# Altium schematic sheet Sheet2.SchDoc
size A4
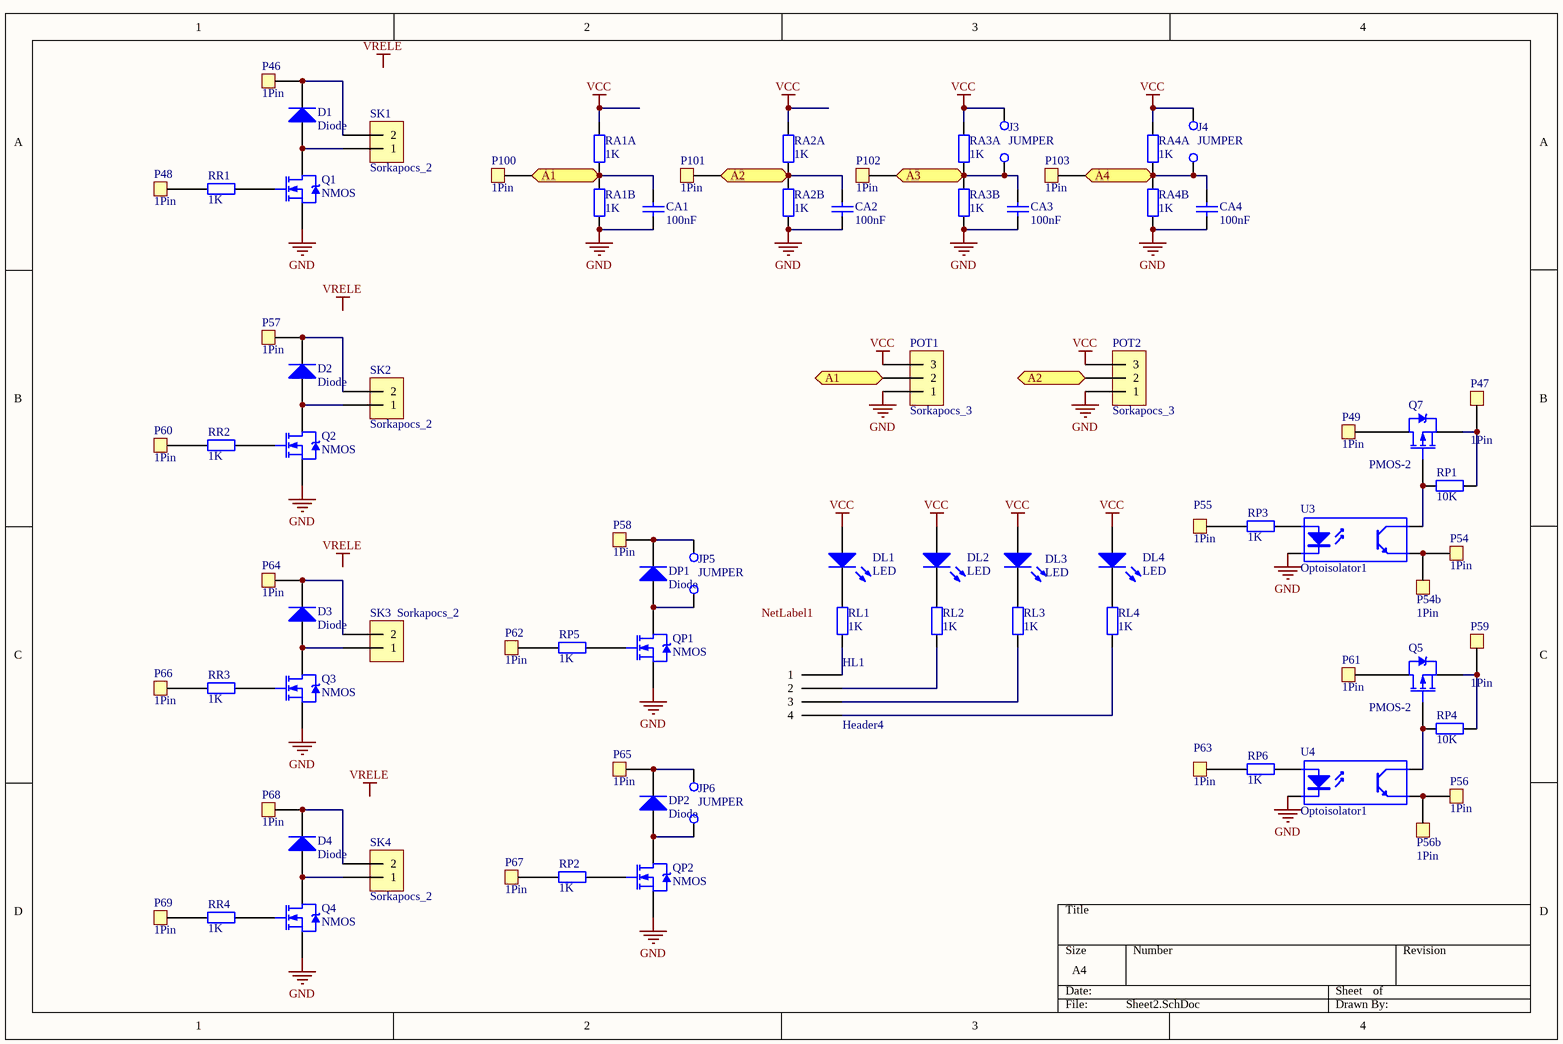
[diagram p0: Sheet2.SchDoc]

## Parts
CA1  100nF  [FP_0805_CAP_085]
CA2  100nF  [FP_0805_CAP_085]
CA3  100nF  [FP_0805_CAP_085]
CA4  100nF  [FP_0805_CAP_085]
D1  Diode  [DO214]
D2  Diode  [DO214]
D3  Diode  [DO214]
D4  Diode  [DO214]
DL1  LED  [FP_0805_LED_RED]
DL2  LED  [FP_0805_LED_RED]
DL3  LED  [FP_0805_LED_RED]
DL4  LED  [FP_0805_LED_RED]
DP1  Diode  [DO214]
DP2  Diode  [DO214]
HL1  Header4  [FP_CONN4_TUSKE_254MM]
J3  JUMPER  [FP_CONN2_TUSKE_254MM]
J4  JUMPER  [FP_CONN2_TUSKE_254MM]
JP5  JUMPER  [FP_CONN2_TUSKE_254MM]
JP6  JUMPER  [FP_CONN2_TUSKE_254MM]
P46  1Pin  [Header1]
P47  1Pin  [Header1]
P48  1Pin  [Header1]
P49  1Pin  [Header1]
P54  1Pin  [Header1]
P54b  1Pin  [Header1]
P55  1Pin  [Header1]
P56  1Pin  [Header1]
P56b  1Pin  [Header1]
P57  1Pin  [Header1]
P58  1Pin  [Header1]
P59  1Pin  [Header1]
P60  1Pin  [Header1]
P61  1Pin  [Header1]
P62  1Pin  [Header1]
P63  1Pin  [Header1]
P64  1Pin  [Header1]
P65  1Pin  [Header1]
P66  1Pin  [Header1]
P67  1Pin  [Header1]
P68  1Pin  [Header1]
P69  1Pin  [Header1]
P100  1Pin  [Header1]
P101  1Pin  [Header1]
P102  1Pin  [Header1]
P103  1Pin  [Header1]
POT1  Sorkapocs_3  [SORKAPOCS_3]
POT2  Sorkapocs_3  [SORKAPOCS_3]
Q1  NMOS  [SOT95P245X110-3N]
Q2  NMOS  [SOT95P245X110-3N]
Q3  NMOS  [SOT95P245X110-3N]
Q4  NMOS  [SOT95P245X110-3N]
Q5  PMOS-2  [SOT95P245X110-3N]
Q7  PMOS-2  [SOT95P245X110-3N]
QP1  NMOS  [SOT95P245X110-3N]
QP2  NMOS  [SOT95P245X110-3N]
RA1A  value 1K  [0805]  (hidden comment: Resistor)
RA1B  value 1K  [0805]  (hidden comment: Resistor)
RA2A  value 1K  [0805]  (hidden comment: Resistor)
RA2B  value 1K  [0805]  (hidden comment: Resistor)
RA3A  value 1K  [0805]  (hidden comment: Resistor)
RA3B  value 1K  [0805]  (hidden comment: Resistor)
RA4A  value 1K  [0805]  (hidden comment: Resistor)
RA4B  value 1K  [0805]  (hidden comment: Resistor)
RL1  value 1K  [0805]  (hidden comment: Resistor)
RL2  value 1K  [0805]  (hidden comment: Resistor)
RL3  value 1K  [0805]  (hidden comment: Resistor)
RL4  value 1K  [0805]  (hidden comment: Resistor)
RP1  value 10K  [0805]  (hidden comment: Resistor)
RP2  value 1K  [0805]  (hidden comment: Resistor)
RP3  value 1K  [0805]  (hidden comment: Resistor)
RP4  value 10K  [0805]  (hidden comment: Resistor)
RP5  value 1K  [0805]  (hidden comment: Resistor)
RP6  value 1K  [0805]  (hidden comment: Resistor)
RR1  value 1K  [0805]  (hidden comment: Resistor)
RR2  value 1K  [0805]  (hidden comment: Resistor)
RR3  value 1K  [0805]  (hidden comment: Resistor)
RR4  value 1K  [0805]  (hidden comment: Resistor)
SK1  Sorkapocs_2  [SORKAPOCS_2]
SK2  Sorkapocs_2  [SORKAPOCS_2]
SK3  Sorkapocs_2  [SORKAPOCS_2]
SK4  Sorkapocs_2  [SORKAPOCS_2]
U3  Optoisolator1  [DIP-4]
U4  Optoisolator1  [DIP-4]

## Ports
A1, A2, A3, A4

## Nets
GND: CA1.1 CA2.1 CA3.1 CA4.1 POT1.1 POT2.1 Q1.S Q2.S Q3.S Q4.S QP1.S QP2.S RA1B.1 RA2B.1 RA3B.1 RA4B.1 U3.2(K) U4.2(K)
VCC: DL1.1(A) DL2.1(A) DL3.1(A) DL4.1(A) J3.2(C2) J4.2(C2) POT1.3 POT2.3 RA1A.2 RA2A.2 RA3A.2 RA4A.2
A1: CA1.2 P100.1 POT1.2 RA1A.1 RA1B.2 ; port A1
A2: CA2.2 P101.1 POT2.2 RA2A.1 RA2B.2 ; port A2
A3: CA3.2 J3.1(C1) P102.1 RA3A.1 RA3B.2 ; port A3
A4: CA4.2 J4.1(C1) P103.1 RA4A.1 RA4B.2 ; port A4
NetD1_1: D1.1(A) Q1.D SK1.1
NetD1_2: D1.2(K) P46.1 SK1.2
NetD2_1: D2.1(A) Q2.D SK2.1
NetD2_2: D2.2(K) P57.1 SK2.2
NetD3_1: D3.1(A) Q3.D SK3.1
NetD3_2: D3.2(K) P64.1 SK3.2
NetD4_1: D4.1(A) Q4.D SK4.1
NetD4_2: D4.2(K) P68.1 SK4.2
NetDL1_2: DL1.2(K) RL1.2
NetDL2_2: DL2.2(K) RL2.2
NetDL3_2: DL3.2(K) RL3.2
NetDL4_2: DL4.2(K) RL4.2
NetDP1_1: DP1.1(A) JP5.1(C1) QP1.D
NetDP1_2: DP1.2(K) JP5.2(C2) P58.1
NetDP2_1: DP2.1(A) JP6.1(C1) QP2.D
NetDP2_2: DP2.2(K) JP6.2(C2) P65.1
NetHL1_1: HL1.1 RL1.1
NetHL1_2: HL1.2 RL2.1
NetHL1_3: HL1.3 RL3.1
NetHL1_4: HL1.4 RL4.1
NetP47_1: P47.1 Q7.S RP1.1
NetP48_1: P48.1 RR1.2
NetP49_1: P49.1 Q7.D
NetP54_1: P54.1 P54b.1 U3.3(E)
NetP55_1: P55.1 RP3.2
NetP56_1: P56.1 P56b.1 U4.3(E)
NetP59_1: P59.1 Q5.S RP4.1
NetP60_1: P60.1 RR2.2
NetP61_1: P61.1 Q5.D
NetP62_1: P62.1 RP5.2
NetP63_1: P63.1 RP6.2
NetP66_1: P66.1 RR3.2
NetP67_1: P67.1 RP2.2
NetP69_1: P69.1 RR4.2
NetQ1_G: Q1.G RR1.1
NetQ2_G: Q2.G RR2.1
NetQ3_G: Q3.G RR3.1
NetQ4_G: Q4.G RR4.1
NetQ5_G: Q5.G RP4.2 U4.4(C)
NetQ7_G: Q7.G RP1.2 U3.4(C)
NetQP1_G: QP1.G RP5.1
NetQP2_G: QP2.G RP2.1
NetRP3_1: RP3.1 U3.1(A)
NetRP6_1: RP6.1 U4.1(A)

## Notes on the sheet
- Labels drawn without touching a wire or pin: NetLabel1, VRELE

## Library data of the parts
CA1-CA4 = CAP: Capacitor; Value: 100nF
DL1-DL4 = LED: Typical RED GaAs LED; pin to pad: 1>A 2>K
J3 J4 JP5 JP6 = JUMPER: Jumper Wire; Supplier: Farnell 1668537×1/6
Q1-Q4 QP1 QP2 = NMOS: N-Channel Power MOSFET; pin to pad: D>3 G>1 S>2; Note: Pin 2 is electrically connected to pin 4.; Published: 8-Jun-2000; LatestRevisionDate: 17-Jul-2002; LatestRevisionNote: Re-released for DXP Platform.; DatasheetDocument: PD-9.814; PackageReference: TO-220AB; Publisher: Altium Limited; Code_JEDEC: TO-220-AB; ComponentLink1Description: Manufacturer Link; ComponentLink1URL: http://www.irf.com/
Q5 Q7 = PMOS-2: P-Channel Power MOSFET; pin to pad: D>3 G>1 S>2; Note: Pin 4 not drawn and electrically connected to Pin 2.; Published: 8-Jun-2000; LatestRevisionDate: 17-Jul-2002; LatestRevisionNote: Re-released for DXP Platform.; DatasheetVersion: PD-9.390D; PackageVersion: Feb-1997; PackageReference: TO-220AB; Publisher: Altium Limited; PackageDescription: TO, Thru-Hole, Vertical, Heatsink Mounted; 3 In-Line Leads; Pitch 2.54 mm; ComponentLink1Description: Manufacturer Link; ComponentLink1URL: http://www.irf.com/
U3 U4 = Optoisolator1: 4-Pin Phototransistor Optocoupler; Published: 24-Mar-1999; LatestRevisionDate: 04-Mar-2005; LatestRevisionNote: Sch pins 3 & 4 Swapped.; DatasheetVersion: Nov-2003; PackageReference: DIP-4; Publisher: Altium Limited
D1-D4 DP1 DP2 = Diode: Published: 8-Jun-2000; LatestRevisionDate: 17-Jul-2002; LatestRevisionNote: Re-released for DXP Platform.; DatasheetDocument: 6-Aug-1999; PackageReference: DO-35; Publisher: Altium Limited; Code_JEDEC: DO-204-AH; ComponentLink1Description: Manufacturer Link; ComponentLink1URL: http://www.vishay.com/; ComponentLink2Description: Datasheet; ComponentLink2URL: http://www.vishay.com/docs/85588/85588.pdf
RA1A RA1B RA2A RA2B RA3A RA3B RA4A RA4B RL1-RL4 RP1-RP6 RR1-RR4 = Resistor: Published: 8-Jun-2000; LatestRevisionDate: 17-Jul-2002; LatestRevisionNote: Re-released for DXP Platform.; PackageReference: AXIAL-0.4; Publisher: Altium Limited